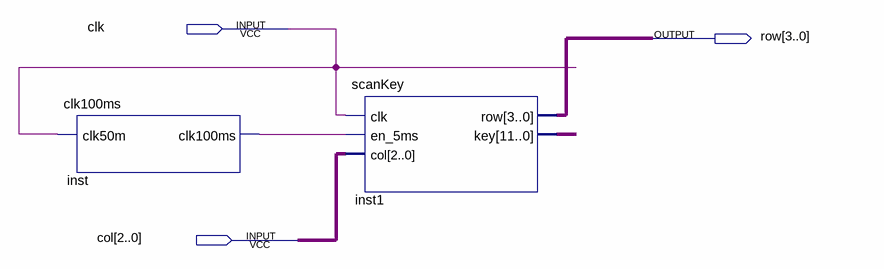
[diagram p0: schematic sheet]
// Quartus schematic mattmustdie.bdf as structural Verilog: 2 symbols, 3 pins
module mattmustdie (
  input  clk,
  input  [2:0] col,
  output [3:0] row
);

  wire inst_clk100ms;
  wire [11:0] inst1_key;

  clk100ms inst (.clk50m(clk), .clk100ms(inst_clk100ms));
  scanKey inst1 (.clk(clk), .en_5ms(inst_clk100ms), .col(col), .row(row), .key(inst1_key));
endmodule
